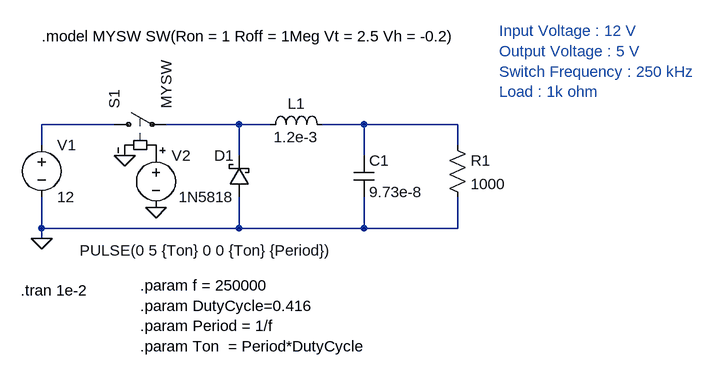
[diagram p0: schematic BuckConverter.asc]
BuckConverter.asc, the LTspice schematic file:
Version 4
SHEET 1 1092 680
WIRE 144 96 32 96
WIRE 336 96 224 96
WIRE 384 96 336 96
WIRE 528 96 464 96
WIRE 672 96 528 96
WIRE 32 128 32 96
WIRE 672 128 672 96
WIRE 336 144 336 96
WIRE 528 144 528 96
WIRE 32 256 32 208
WIRE 336 256 336 208
WIRE 336 256 32 256
WIRE 528 256 528 208
WIRE 528 256 336 256
WIRE 672 256 672 208
WIRE 672 256 528 256
WIRE 32 272 32 256
FLAG 32 272 0
FLAG 160 144 0
FLAG 208 224 0
SYMBOL voltage 32 112 R0
WINDOW 123 0 0 Left 0
WINDOW 39 0 0 Left 0
SYMATTR InstName V1
SYMATTR Value 12
SYMBOL sw 128 96 R270
SYMATTR InstName S1
SYMATTR Value MYSW
SYMBOL voltage 208 128 R0
WINDOW 3 -117 162 Left 2
WINDOW 123 0 0 Left 0
WINDOW 39 0 0 Left 0
SYMATTR Value PULSE(0 5 {Ton} 0 0 {Ton} {Period})
SYMATTR InstName V2
SYMBOL schottky 352 208 R180
WINDOW 0 24 64 Left 2
WINDOW 3 24 0 Left 2
SYMATTR InstName D1
SYMATTR Value 1N5818
SYMATTR Description Diode
SYMATTR Type diode
SYMBOL ind 368 112 R270
WINDOW 0 32 56 VTop 2
WINDOW 3 -19 56 VTop 2
SYMATTR InstName L1
SYMATTR Value 1.2e-3
SYMBOL cap 512 144 R0
SYMATTR InstName C1
SYMATTR Value 9.73e-8
SYMBOL res 656 112 R0
SYMATTR InstName R1
SYMATTR Value 1000
TEXT 32 -40 Left 2 !.model MYSW SW(Ron = 1 Roff = 1Meg Vt = 2.5 Vh = -0.2)
TEXT 184 344 Left 2 !.param f = 250000\n.param DutyCycle=0.416\n.param Period = 1/f\n.param Ton  = Period*DutyCycle
TEXT 0 352 Left 2 !.tran 1e-2
TEXT 736 -48 Left 2 ;Input Voltage : 12 V\nOutput Voltage : 5 V\nSwitch Frequency : 250 kHz\nLoad : 1k ohm

The netlist it stands for:
* BuckConverter.asc
V1 N001 0 12
S1 N001 N002 P001 0 MYSW
V2 P001 0 PULSE(0 5 {Ton} 0 0 {Ton} {Period})
D1 0 N002 1N5818
L1 N002 N003 1.2e-3
C1 N003 0 9.73e-8
R1 N003 0 1000
.model D D
.lib standard.dio
.model MYSW SW(Ron = 1 Roff = 1Meg Vt = 2.5 Vh = -0.2)
.param f = 250000
.param DutyCycle=0.416
.param Period = 1/f
.param Ton  = Period*DutyCycle
.tran 1e-2
* Input Voltage : 12 V
* Output Voltage : 5 V
* Switch Frequency : 250 kHz
* Load : 1k ohm
.backanno
.end